# Altium schematic sheet Rev05MergeRedux--LED_external.SchDoc
size A4; CompanyName: Technische Hochschule Nürnberg Georg Simon Ohm; Organization: UltraZohm; Address1: Kesslerplatz 12; Address2: 90489 Nürnberg; Address3: GERMANY; SheetNumber: 25; SheetTotal: 36; Website: www.ultrazohm.com
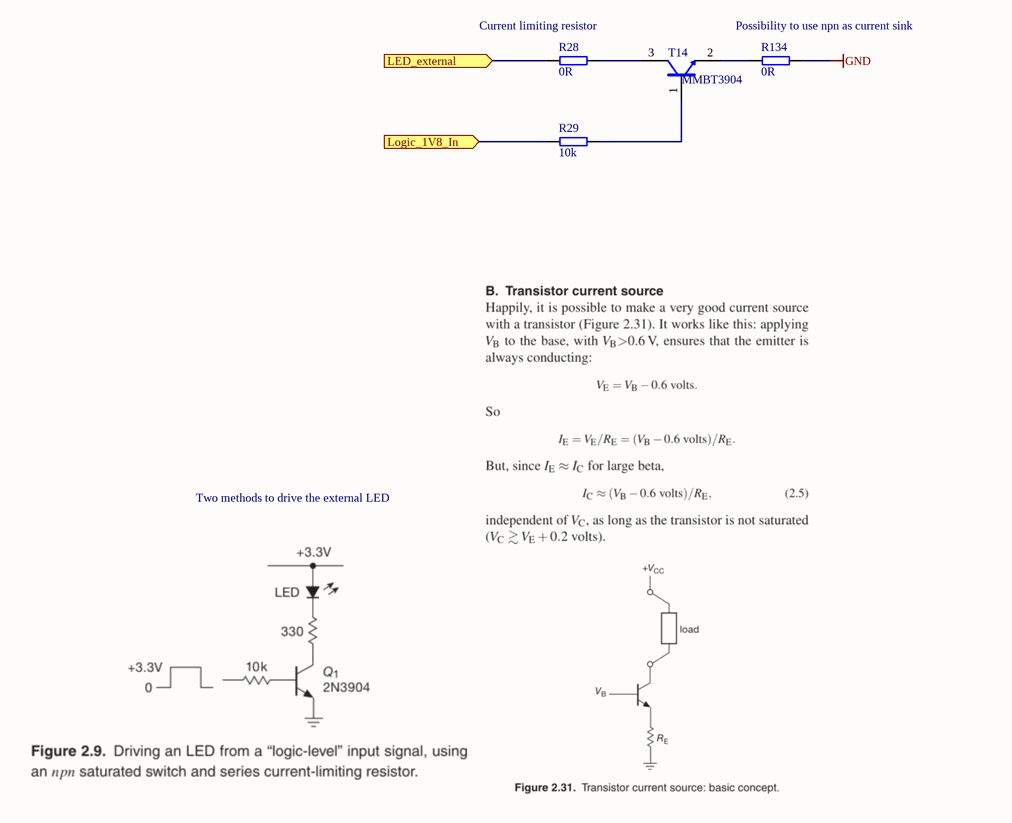
[diagram p0: Rev05MergeRedux--LED_external.SchDoc]

## Parts
R28  0R  [R_0603_TE]
R29  10k  [R_0603_TE]
R134  0R  [R_0603_TE]
T14  MMBT3904  [SOT95P280X145-3N]

## Ports
LED_external (in), Logic_1V8_In (in)

## Nets
GND: R134.1
LED_external: R28.2 ; port LED_external
Logic_1V8_In: R29.1 ; port Logic_1V8_In
NetR28_1: R28.1 T14.3(COLLECTOR)
NetR29_2: R29.2 T14.1(BASIS)
NetR134_2: R134.2 T14.2(EMITTER)

## Notes on the sheet
- (near R28) Current limiting resistor
- (near R134) Possibility to use npn as current sink
- Two methods to drive the external LED
- Title
- Revision:
- Design Engineer:
- Date:
- Project:
- Sheet
- of

## Library data of the parts
R28 R134 = UZgen_R_0603_0R: Generic resistor; Manufacturer: UZgen; Tolerance: 1 %; Created from: UZgenTool; Value: 0R; Manufacturer Part Number: UZgen_R_0603_0R; PartID: 581; Created On: 08.07.2024 14:34:30; Device Package: 0603; Mounting Type: SMD; Last Updated: 08.07.2024 14:34:30
R29 = UZgen_R_0603_10k: Generic resistor; Manufacturer: UZgen; Tolerance: 1 %; Created from: AGeiger; Value: 10k; Manufacturer Part Number: UZgen_R_0603_10k; PartID: 1; Created On: 02.07.2024 14:34:53; Device Package: 0603; Mounting Type: SMD; Last Updated: 02.07.2024 14:37:16
T14 = 23806: AN: 23806; Mixed: SMT; Trenz-Stock: Yes; Extra: NPN General Purpose Amplifier; Case: SOT23-3; HelpURL: B:\AD\adlib\datasheet\MMBT3904; Preferred: Yes; H-ART: MMBT3904